# EAGLE design main (EAGLE 9.1.0)
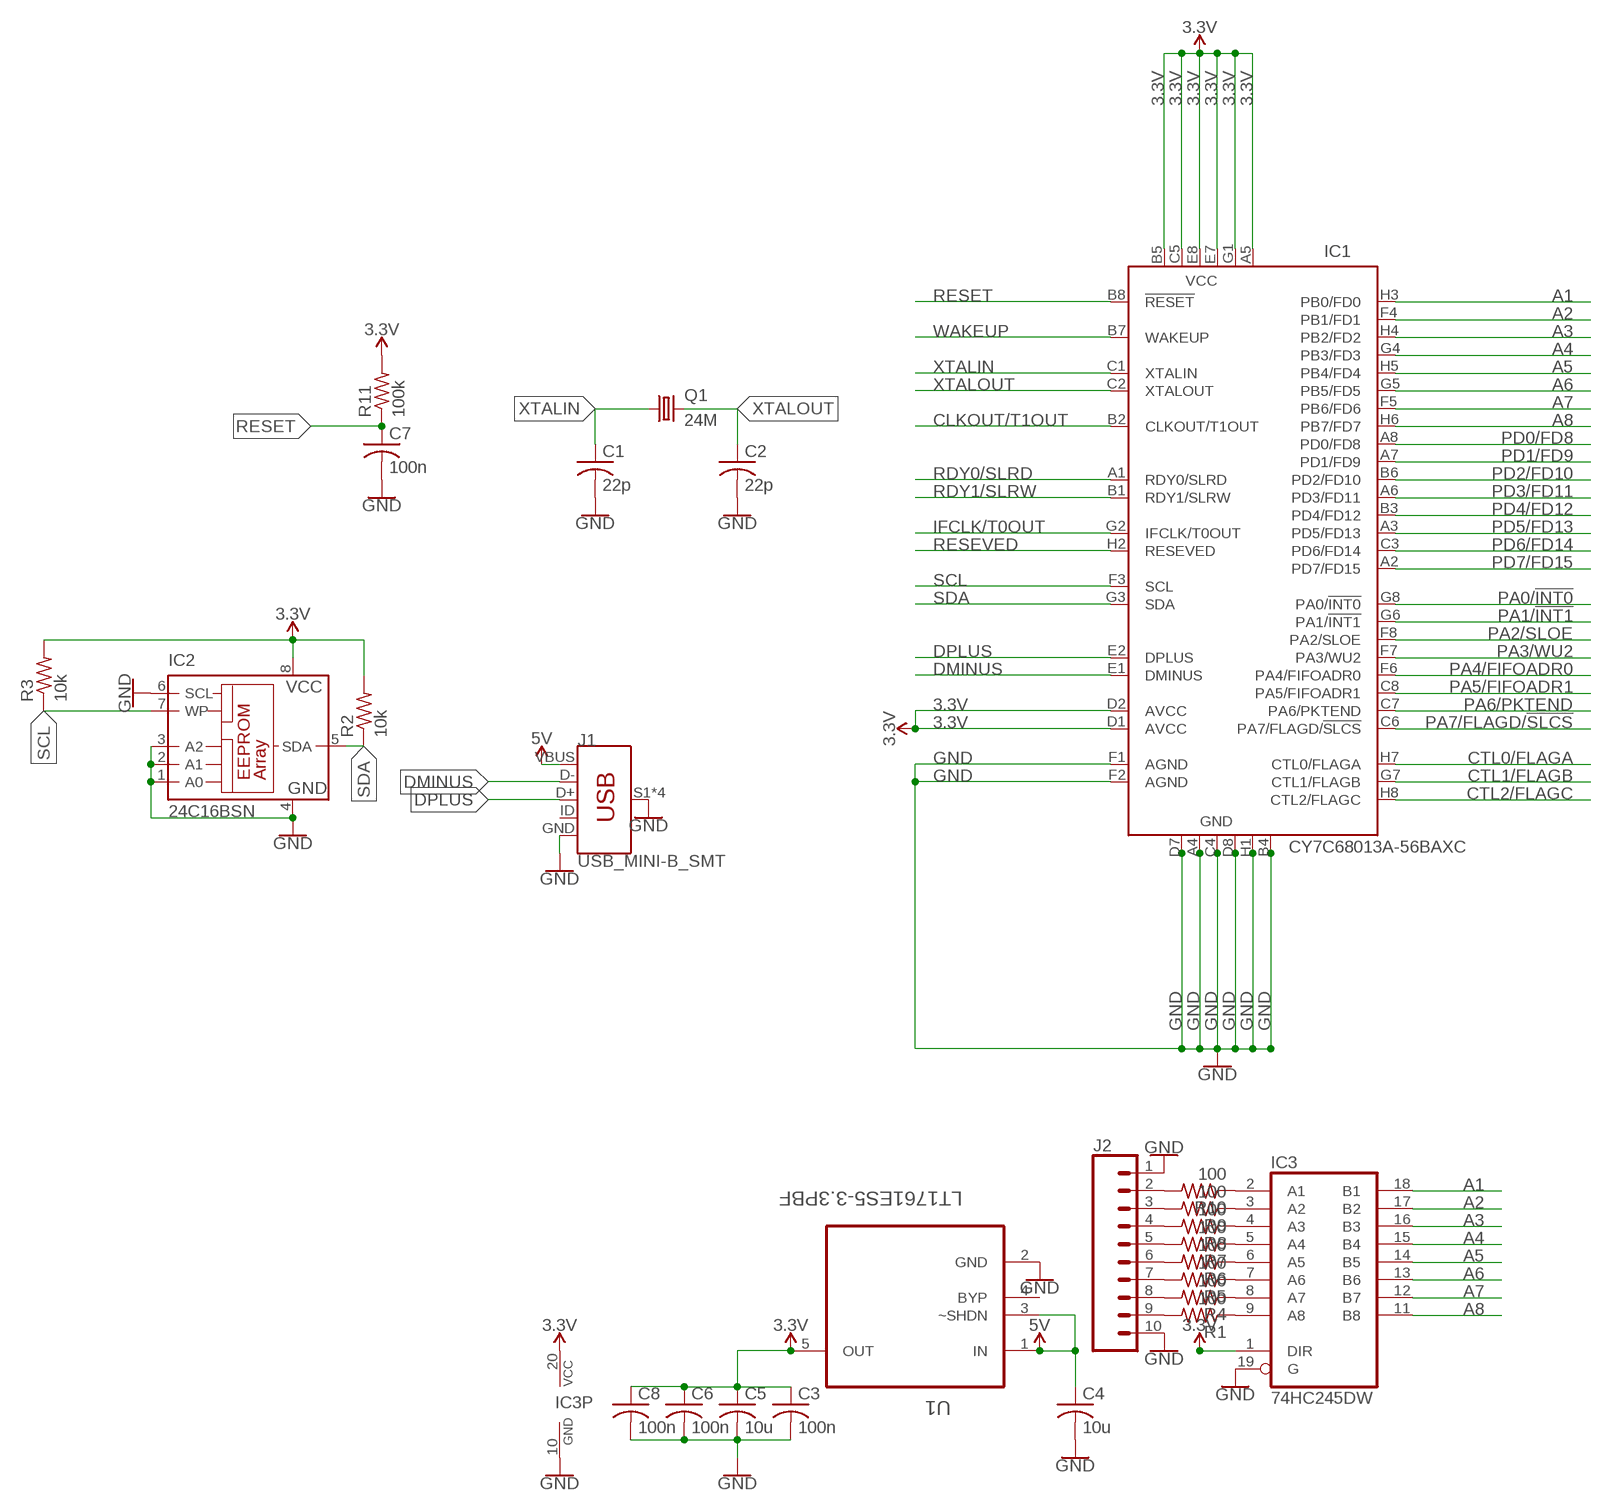
[diagram p0: schematic, sheet 1]

## Parts
C1  22p  C-USC0201  [C0201]
C2  22p  C-USC0201  [C0201]
C3  100n  C-USC0201  [C0201]
C4  10u  C-USC0603K  [C0603K]
C5  10u  C-USC0603K  [C0603K]
C6  100n  C-USC0201  [C0201]
C7  100n  C-USC0201  [C0201]
C8  100n  C-USC0201  [C0201]
IC1  CY7C68013A-56BAXC  [VFBGA56]
IC2  24C16BSN  [SO-08]
IC3  74HC245DW  [SO20W]
J1  USB_MINI-B_SMT  [USB-MINIB]
J2  CONN_10SMD  [1X10_SMD]
Q1  24M  CSM-7X-DU  [CSM-7X-DU]
R1  100  R-US_R0201  [R0201]
R2  10k  R-US_R0201  [R0201]
R3  10k  R-US_R0201  [R0201]
R4  100  R-US_R0201  [R0201]
R5  100  R-US_R0201  [R0201]
R6  100  R-US_R0201  [R0201]
R7  100  R-US_R0201  [R0201]
R8  100  R-US_R0201  [R0201]
R9  100  R-US_R0201  [R0201]
R10  100  R-US_R0201  [R0201]
R11  100k  R-US_R0201  [R0201]
U1  LT1761ES5-3.3PBF  [SOT95P280X100-5N]

## Nets
3.3V: C3.1 C5.1 C6.1 C8.1 IC1.A5(VCC) IC1.B5(VCC) IC1.C5(VCC) IC1.D1(AVCC) IC1.D2(AVCC) IC1.E7(VCC) IC1.E8(VCC) IC1.G1(VCC) IC2.8(VCC) IC3.1(DIR) IC3.20(VCC) R2.2 R3.2 R11.2 U1.5(OUT)
5V: C4.1 J1.VBUS U1.1(IN) U1.3(~SHDN)
A1: IC1.H3(PB0/FD0) IC3.18(B1)
A2: IC1.F4(PB1/FD1) IC3.17(B2)
A3: IC1.H4(PB2/FD2) IC3.16(B3)
A4: IC1.G4(PB3/FD3) IC3.15(B4)
A5: IC1.H5(PB4/FD4) IC3.14(B5)
A6: IC1.G5(PB5/FD5) IC3.13(B6)
A7: IC1.F5(PB6/FD6) IC3.12(B7)
A8: IC1.H6(PB7/FD7) IC3.11(B8)
CLKOUT/T1OUT: IC1.B2(CLKOUT/T1OUT)
CTL0/FLAGA: IC1.H7(CTL0/FLAGA)
CTL1/FLAGB: IC1.G7(CTL1/FLAGB)
CTL2/FLAGC: IC1.H8(CTL2/FLAGC)
DMINUS: IC1.E1(DMINUS) J1.D-
DPLUS: IC1.E2(DPLUS) J1.D+
GND: C1.2 C2.2 C3.2 C4.2 C5.2 C6.2 C7.2 C8.2 IC1.A4(GND) IC1.B4(GND) IC1.C4(GND) IC1.D7(GND) IC1.D8(GND) IC1.F1(AGND) IC1.F2(AGND) IC1.H1(GND) IC2.1(A0) IC2.2(A1) IC2.3(A2) IC2.4(GND) IC2.6(SCL) IC3.10(GND) IC3.19(G) J1.GND J1.S1(SHIELD) J1.S2(SHIELD) J1.S3(SHIELD) J1.S4(SHIELD) J2.1 J2.10 U1.2(GND)
IFCLK/T0OUT: IC1.G2(IFCLK/T0OUT)
N$1: IC3.9(A8) R1.1
N$2: IC3.8(A7) R4.1
N$3: IC3.7(A6) R5.1
N$4: IC3.6(A5) R6.1
N$5: IC3.5(A4) R7.1
N$6: IC3.4(A3) R8.1
N$7: IC3.3(A2) R9.1
N$8: IC3.2(A1) R10.1
N$9: J2.9 R1.2
N$10: J2.8 R4.2
N$11: J2.7 R5.2
N$12: J2.6 R6.2
N$13: J2.5 R7.2
N$14: J2.4 R8.2
N$15: J2.3 R9.2
N$16: J2.2 R10.2
PA0/!INT0: IC1.G8(PA0/!INT0)
PA1/!INT1: IC1.G6(PA1/!INT1)
PA2/SLOE: IC1.F8(PA2/SLOE)
PA3/WU2: IC1.F7(PA3/WU2)
PA4/FIFOADR0: IC1.F6(PA4/FIFOADR0)
PA5/FIFOADR1: IC1.C8(PA5/FIFOADR1)
PA6/PKTEND: IC1.C7(PA6/PKTEND)
PA7/FLAGD/!SLCS: IC1.C6(PA7/FLAGD/!SLCS)
PD0/FD8: IC1.A8(PD0/FD8)
PD1/FD9: IC1.A7(PD1/FD9)
PD2/FD10: IC1.B6(PD2/FD10)
PD3/FD11: IC1.A6(PD3/FD11)
PD4/FD12: IC1.B3(PD4/FD12)
PD5/FD13: IC1.A3(PD5/FD13)
PD6/FD14: IC1.C3(PD6/FD14)
PD7/FD15: IC1.A2(PD7/FD15)
RDY0/SLRD: IC1.A1(RDY0/SLRD)
RDY1/SLRW: IC1.B1(RDY1/SLRW)
RESET: C7.1 IC1.B8(!RESET) R11.1
RESEVED: IC1.H2(RESEVED)
SCL: IC1.F3(SCL) IC2.7(WP) R3.1
SDA: IC1.G3(SDA) IC2.5(SDA) R2.1
WAKEUP: IC1.B7(WAKEUP)
XTALIN: C1.1 IC1.C1(XTALIN) Q1.1
XTALOUT: C2.1 IC1.C2(XTALOUT) Q1.2
Unconnected: J1.ID U1.4(BYP)

## Library data of the parts
C1-C8 = rcl:C-US: CAPACITOR, American symbol; SPICEPREFIX: C
IC1 = cypress:CY7C6801*A-56: EZ-USB FX2LP (TM) USB Microcontroller Source: http://www.cypress.com .. cy7c68013a_5.pdf; MF: CYPRESS SEMICONDUCTOR CORPORAT; MPN: CY7C68013A-56BAXC; OC_FARNELL: 1269132; OC_NEWARK: 19M7110; SPICEPREFIX: X
IC2 = microchip:24*: Serial EEPROM I2C; MPN: AT24C16BN-SH-B; OC_FARNELL: 1362651; OC_NEWARK: 50M3324
IC3 = 74xx-eu:74*245: Octal BUS TRANSCEIVER, 3-state
J1 = SparkFun-Connectors:USB_MINI-B: USB type Mini-B Connector Breaks out 5th pin, and includes shield pins if needed. SparkFun Products: SparkFun FTDI Basic Breakout <https://www.sparkfun.com/products/9716> SparkFun XBee Explorer USB <https://www.sparkfun.com/products/11812> SparkFun Redboard <https://www.sparkfun.com/products/12757>; PROD_ID: CONN-08193; SF_ID: PRT-00587
J2 = 7_segment_lib:CONN_10: Multi connection point. Often used as Generic Header-pin footprint for 0.1 inch spaced/style header connections On any of the 0.1 inch spaced packages, you can populate with these: Break Away Headers - Straight <https://www.sparkfun.com/products/116> (PRT-00116) Break Away Male Headers - Right Angle <https://www.sparkfun.com/products/553> (PRT-00553) Female Headers <https://www.sparkfun.com/products/115> (PRT-00115) Break Away Headers - Machine Pin <https://www.sparkfun.com/products/117> (PRT-00117) Break Away Female Headers - Swiss Machine Pin <https://www.sparkfun.com/products/743> (PRT-00743) For SCREWTERMINALS and SPRING TERMINALS visit here: Screw Terimnals on SparkFun.com <https://www.sparkfun.com/search/results?term=Screw+Terminals> (5mm/3.5mm/2.54mm spacing) This device is also useful as a general connection point to wire up your design to another part of your project. Our various solder wires solder well into these plated through hole pads. Hook-Up Wire - Assortment (Stranded, 22 AWG) <https://www.sparkfun.com/products/11375> (PRT-11375) Hook-Up Wire - Assortment (Solid Core, 22 AWG) <https://www.sparkfun.com/products/11367> (PRT-11367) View the entire wire category on our website here <https://www.sparkfun.com/categories/141> Special notes: Molex polarized connector foot print use with SKU : PRT-08231 with associated crimp pins and housings. 1MM SMD Version SKU: PRT-10208; PROD_ID: CONN-09140; SF_ID: PRT-12638
Q1 = crystal:CSM-7X-DU: SMD CRYSTAL Source: www.ecsxtal.com .. Crystal 3.6864MHz CSM_7X_DU.PDF; OC_FARNELL: unknown; OC_NEWARK: unknown
R1-R11 = resistor:R-US_: RESISTOR, American symbol
U1 = LTC_By_element14_Batch_1:LT1761ES5-3.3PBF: 100mA, Low Noise,LDO Micropower Regulators; MPN: LT1761ES5-3.3#PBF; OC_FARNELL: 1531493; OC_NEWARK: 61M3358; PACKAGE: TSOT-23-5; SUPPLIER: Linear Technology

## Board
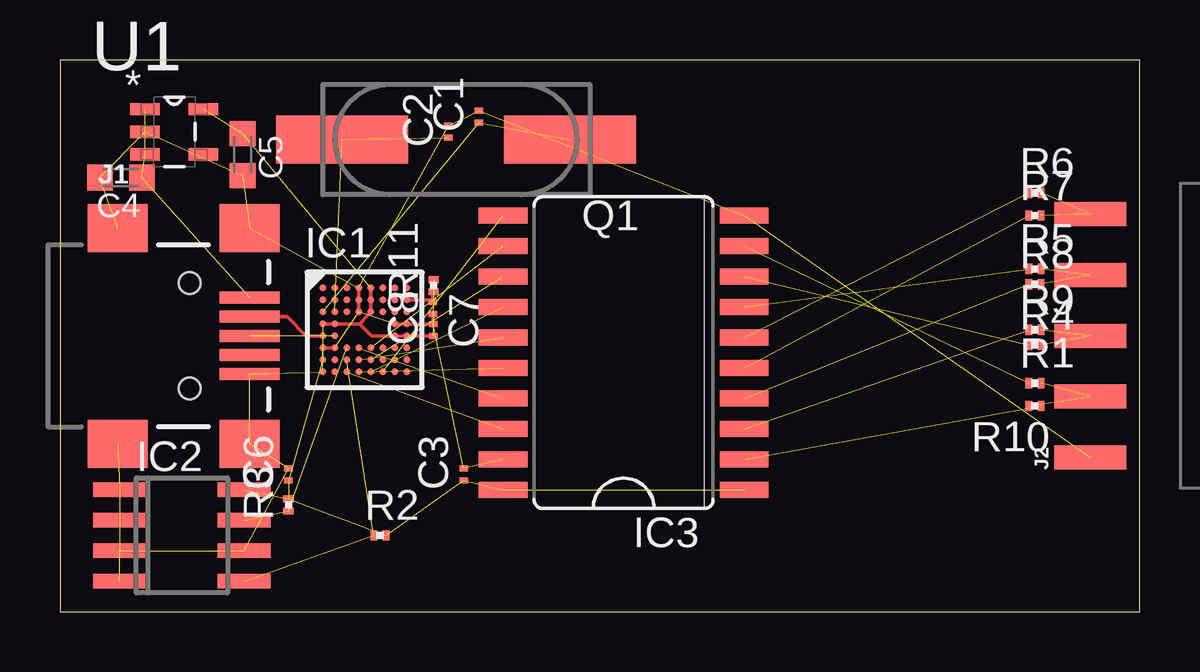
[diagram p1: board, top side]
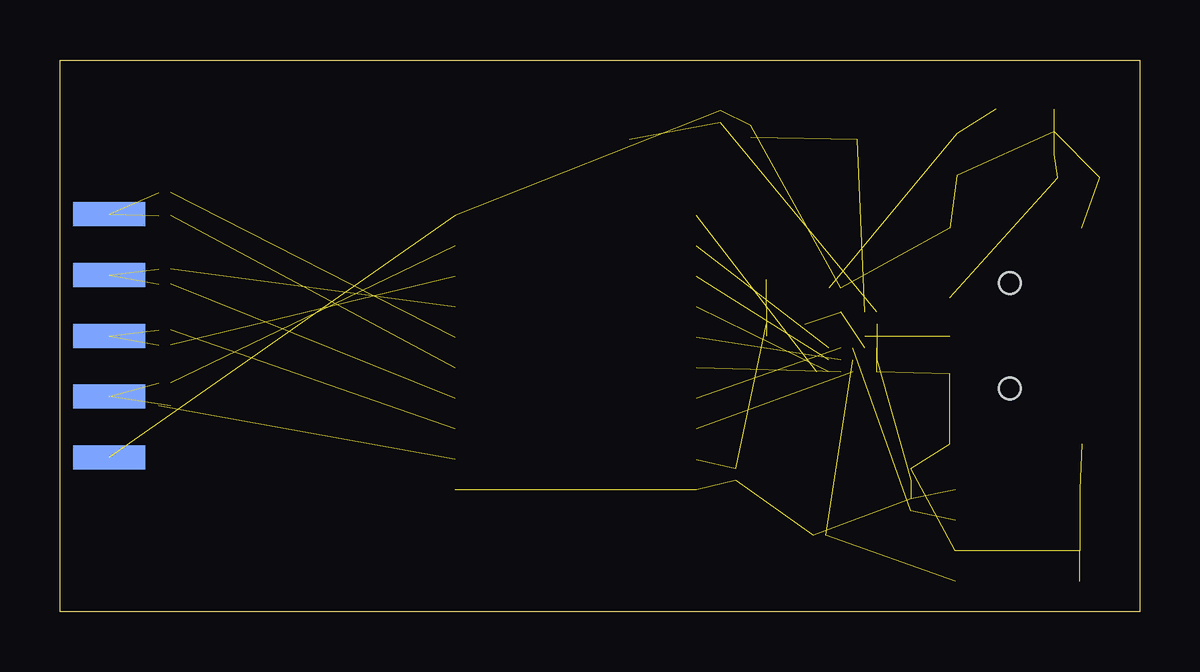
[diagram p2: board, bottom side, seen from below]

Size 45 x 23 mm. Coordinates in mm from the lower left corner, seen from the top.
Outline: 0,0 45,0 45,23 0,23 0,0
Copper layers (1*16): Top 0.035mm / dielectric 1.5mm / Bottom 0.035mm
Design rules "default": minimum track width 6mil, minimum drill 0.35mm, track to track 6mil, track to pad 6mil, pad to pad 6mil, via to via 6mil, smd to smd 6mil, copper to edge 40mil, drill to drill 6mil, minimum pad ring 10mil, minimum via ring 8mil, stop-mask expansion 4mil, vias tented up to drill 0mil, thermal gap 10mil

### Footprints (pad centres in the part's own frame; a part is rotated, then mirrored left to right if it is on the bottom)
C0201 = smd 0.25 x 0.35: 1 -0.25,0; 2 0.25,0
C0603K = smd 1.05 x 1.08: 1 -0.875,0; 2 0.875,0
VFBGA56 = smd 0.3 x 0.3: A1 -1.75,1.75; A2 -1.25,1.75; A3 -0.75,1.75; A4 -0.25,1.75; A5 0.25,1.75; A6 0.75,1.75; A7 1.25,1.75; A8 1.75,1.75; B1 -1.75,1.25; B2 -1.25,1.25; B3 -0.75,1.25; B4 -0.25,1.25; B5 0.25,1.25; B6 0.75,1.25; B7 1.25,1.25; B8 1.75,1.25; C1 -1.75,0.75; C2 -1.25,0.75; C3 -0.75,0.75; C4 -0.25,0.75; C5 0.25,0.75; C6 0.75,0.75; C7 1.25,0.75; C8 1.75,0.75; D1 -1.75,0.25; D2 -1.25,0.25; D7 1.25,0.25; D8 1.75,0.25; E1 -1.75,-0.25; E2 -1.25,-0.25; E7 1.25,-0.25; E8 1.75,-0.25; F1 -1.75,-0.75; F2 -1.25,-0.75; F3 -0.75,-0.75; F4 -0.25,-0.75; F5 0.25,-0.75; F6 0.75,-0.75; F7 1.25,-0.75; F8 1.75,-0.75; G1 -1.75,-1.25; G2 -1.25,-1.25; G3 -0.75,-1.25; G4 -0.25,-1.25; G5 0.25,-1.25; G6 0.75,-1.25; G7 1.25,-1.25; G8 1.75,-1.25; H1 -1.75,-1.75; H2 -1.25,-1.75; H3 -0.75,-1.75; H4 -0.25,-1.75; H5 0.25,-1.75; H6 0.75,-1.75; H7 1.25,-1.75; H8 1.75,-1.75
SO-08 = smd 0.6 x 2.2: 1 -1.905,-2.6; 2 -0.635,-2.6; 3 0.635,-2.6; 4 1.905,-2.6; 5 1.905,2.6; 6 0.635,2.6; 7 -0.635,2.6; 8 -1.905,2.6
SO20W = smd 0.66 x 2.032: 1 -5.715,-5.029; 2 -4.445,-5.029; 3 -3.175,-5.029; 4 -1.905,-5.029; 5 -0.635,-5.029; 6 0.635,-5.029; 7 1.905,-5.029; 8 3.175,-5.029; 9 4.445,-5.029; 10 5.715,-5.029; 11 5.715,5.029; 12 4.445,5.029; 13 3.175,5.029; 14 1.905,5.029; 15 0.635,5.029; 16 -0.635,5.029; 17 -1.905,5.029; 18 -3.175,5.029; 19 -4.445,5.029; 20 -5.715,5.029
USB-MINIB = smd 2.5 x 0.5: D+ 2.5,0; D- 2.5,0.8; GND 2.5,-1.6; ID 2.5,-0.8; VBUS 2.5,1.6 | smd 2.5 x 2: S1 -3,4.5; S2 2.5,4.5; S3 -3,-4.5; S4 2.5,-4.5 | hole 0.9: 0,2.2; 0,-2.2
1X10_SMD = smd 1 x 3: 1 -5.08,-0.08; 2 -2.54,-0.08; 3 0,-0.08; 4 2.54,-0.08; 5 5.08,-0.08 | smd 1 x 3 bottom: 6 5.08,-0.08; 7 2.54,-0.08; 8 0,-0.08; 9 -2.54,-0.08; 10 -5.08,-0.08
CSM-7X-DU = smd 5.5 x 2: 1 -4.75,0; 2 4.75,0
R0201 = smd 0.28 x 0.43: 1 -0.255,0; 2 0.255,0
SOT95P280X100-5N = smd 1.219 x 0.508: 1 -1.219,0.94; 2 -1.219,0; 3 -1.219,-0.94; 4 1.219,-0.94; 5 1.219,0.94

### Placement (x,y rotation side)
C1  17.46,20.64 90 top
C2  16.19,20 90 top
C3  16.83,5.71 90 top
C4  2.54,18.1 180 top
C5  7.62,19.05 270 top
C6  9.53,5.71 90 top
C7  15.54,12.66 270 top
C8  15.56,11.75 90 top
IC1  12.7,11.75 0 top
IC2  5.08,3.17 270 top
IC3  23.5,10.79 90 top
J1  5.4,11.5 0 top
J2  42.86,11.5 90 top
Q1  16.51,19.68 180 top
R1  40.64,9.53 0 top
R2  13.34,3.17 0 top
R3  9.53,4.45 90 top
R4  40.64,11.11 0 top
R5  40.64,14.29 0 top
R6  40.64,17.46 0 top
R7  40.64,16.51 0 top
R8  40.64,13.65 0 top
R9  40.64,11.75 0 top
R10  40.64,8.57 180 top
R11  15.57,13.59 90 top
U1  4.76,20 0 top

### Tracks (layer width: path | path; a pad name or v marks a point on that pad's centre or on a via)
3.3V  (11 unrouted)
  Top 0.152: C8.1 IC1.E8 IC1.E7 12.98,11.5 12.48,12 | IC1.D1 IC1.D2 12.48,12 | IC1.A5 IC1.B5 IC1.C5 12.83,12.38 12.83,12.34 12.48,12
5V  (3 unrouted)
A1  (1 unrouted)
A2  (1 unrouted)
A3  (1 unrouted)
A4  (1 unrouted)
A5  (1 unrouted)
A6  (1 unrouted)
A7  (1 unrouted)
A8  (1 unrouted)
DMINUS
  Top 0.152: IC1.E1 10.27,11.5 9.47,12.3 J1.D-
DPLUS  (1 unrouted)
GND  (24 unrouted)
  Top 0.152: IC1.D7 IC1.D8 C8.2 15.54,12.01 C7.2 | IC1.C4 IC1.B4 IC1.A4 | IC1.F1 IC1.F2
N$1  (1 unrouted)
N$2  (1 unrouted)
N$3  (1 unrouted)
N$4  (1 unrouted)
N$5  (1 unrouted)
N$6  (1 unrouted)
N$7  (1 unrouted)
N$8  (1 unrouted)
N$9  (1 unrouted)
N$10  (1 unrouted)
N$11  (1 unrouted)
N$12  (1 unrouted)
N$13  (1 unrouted)
N$14  (1 unrouted)
N$15  (1 unrouted)
N$16  (1 unrouted)
RESET
  Top 0.152: IC1.B8 15.46,13 C7.1 | C7.1 | R11.1 15.54,13.3 C7.1
SCL  (2 unrouted)
SDA  (2 unrouted)
XTALIN  (2 unrouted)
XTALOUT  (2 unrouted)